# EAGLE design IR receiver_v10 (EAGLE 6.2)
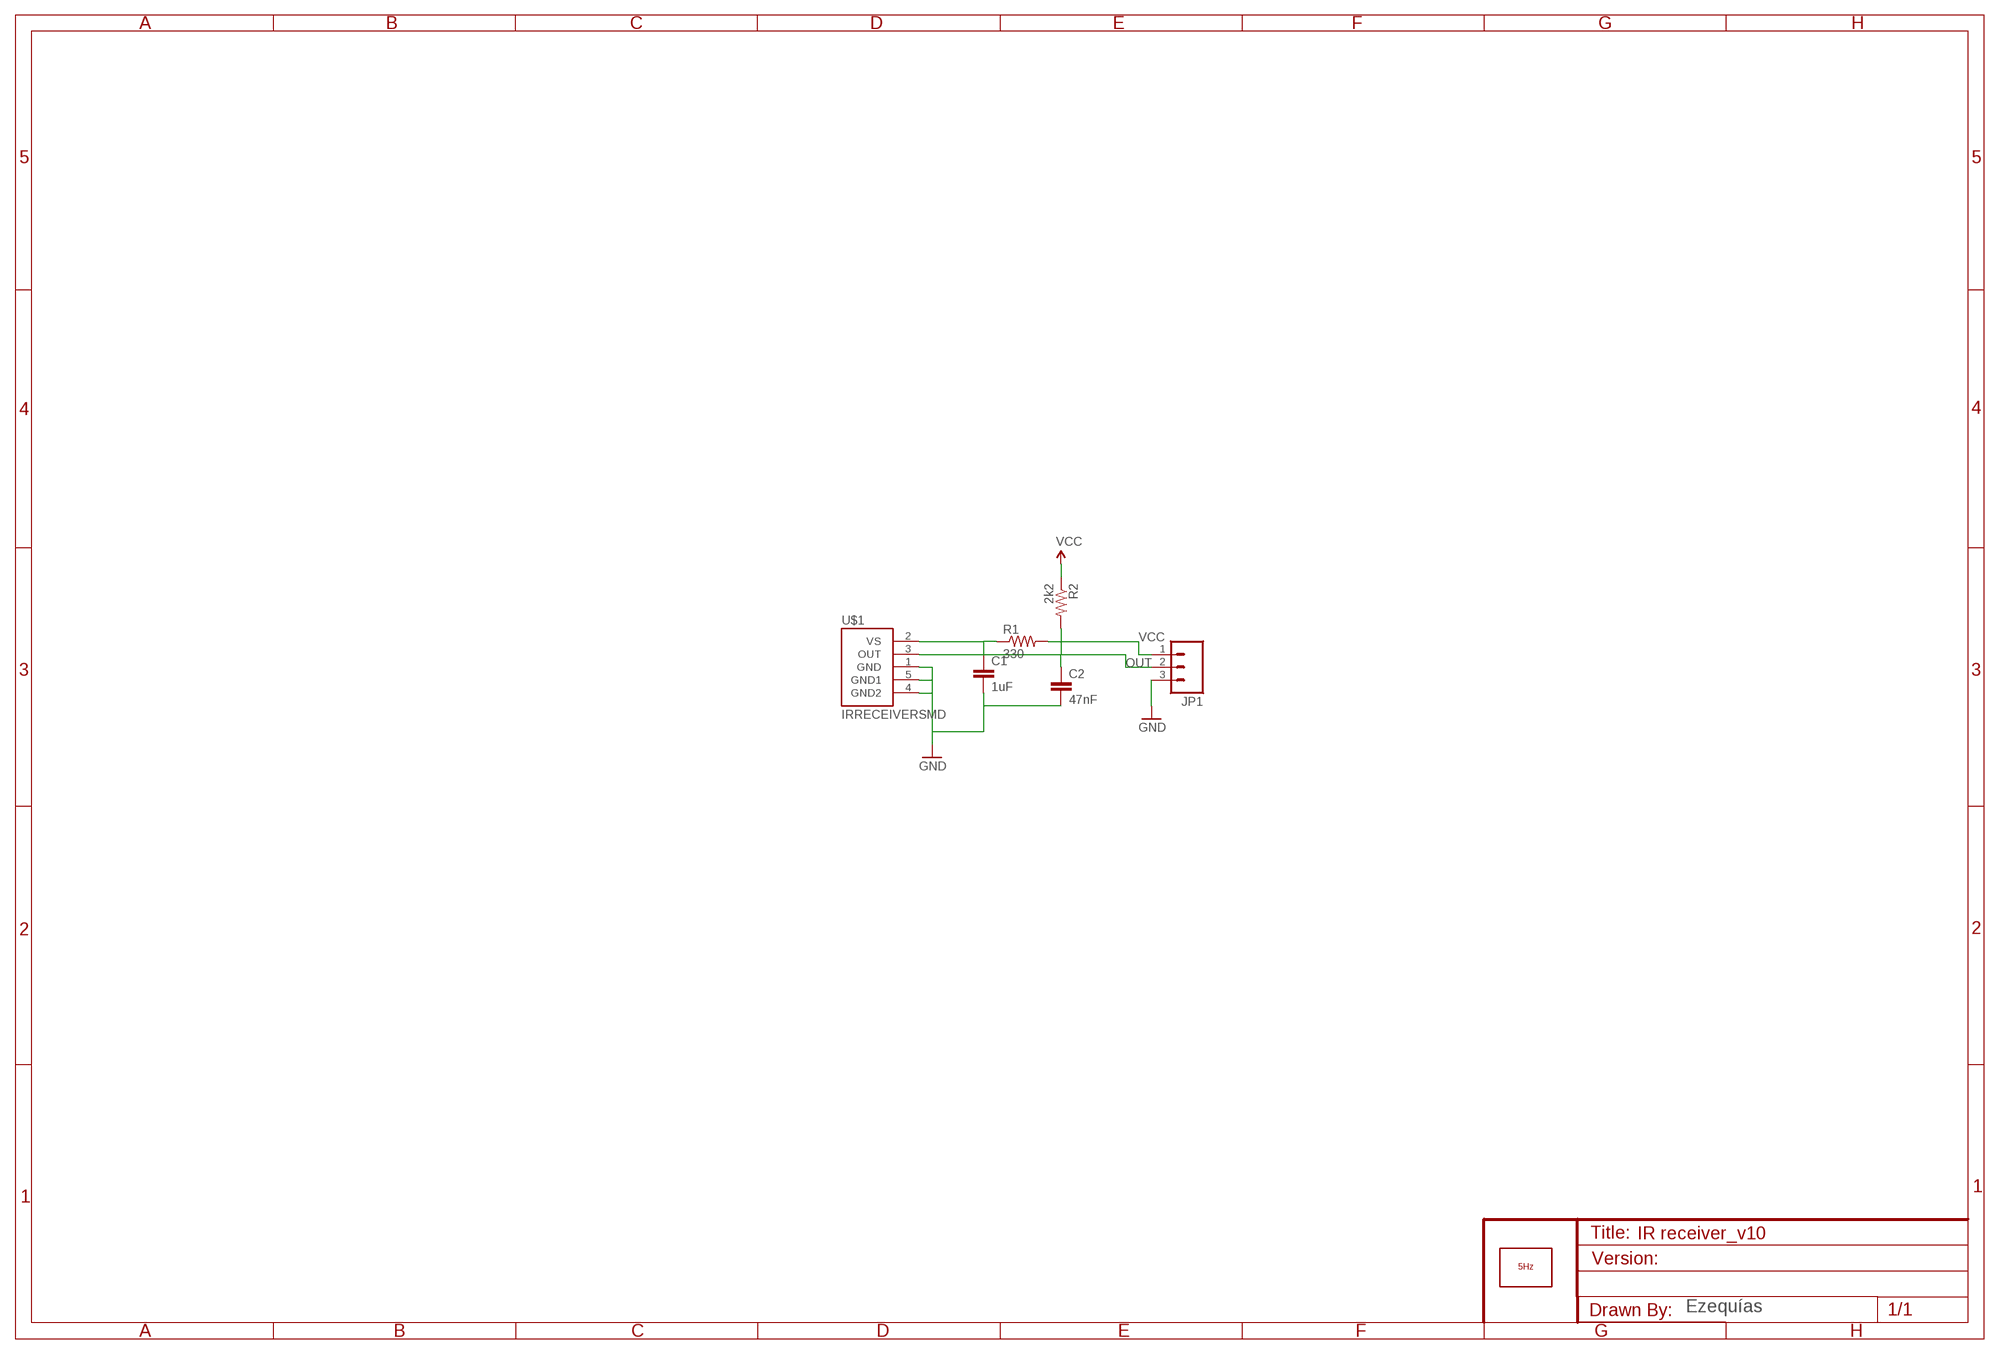
[diagram p0: schematic, sheet 1]

## Parts
C1  1uF  CAP0603-CAP  [0603-CAP]
C2  47nF  CAP0603-CAP  [0603-CAP]
JP1  M03PTH  [1X03]
LOGO1  LOGO_5HZ_MAIN_5MM  [5HZ_LOGO_MAIN_5MM]
R1  330  RESISTOR0603-RES  [0603-RES]
R2  2k2  RESISTOR0603-RES  [0603-RES]
U$1  IRRECEIVERSMD  [TSOP8523]

## Nets
GND: C1.2 C2.2 JP1.3 U$1.1(GND) U$1.4(GND2) U$1.5(GND1)
N$2: C1.1 R1.1 U$1.2(VS)
OUT: C2.1 JP1.2 R2.2 U$1.3(OUT)
VCC: JP1.1 R1.2 R2.1

## Notes on the sheet
- Ezequías

## Library data of the parts
C1 C2 = SparkFun:CAP: Capacitor Standard 0603 ceramic capacitor, and 0.1" leaded capacitor.
JP1 = SparkFun:M03: Header 3 Standard 3-pin 0.1" header. Use with straight break away headers (SKU : PRT-00116), right angle break away headers (PRT-00553), swiss pins (PRT-00743), machine pins (PRT-00117), and female headers (PRT-00115). Molex polarized connector foot print use with SKU : PRT-08232 with associated crimp pins and housings.
LOGO1 = 5hz-electronica:LOGO_5HZ: Logotipo 5Hz "según Pedro"
R1 R2 = SparkFun:RESISTOR: Resistor Basic schematic elements and footprints for 0603, 1206, and PTH resistors.
U$1 = SparkFun:IRRECEIVER: Description: IR receiver with built in demodulation and filtering. SparkFun SKU: SEN-08545

## Board
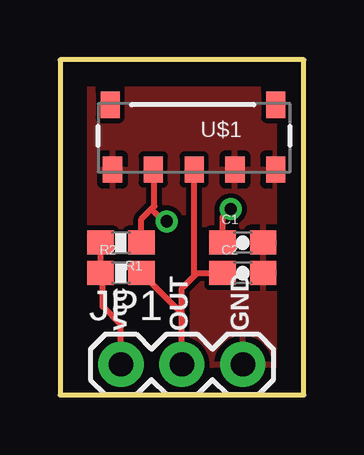
[diagram p1: board, top side]
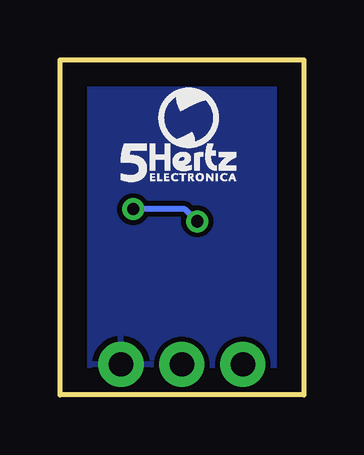
[diagram p2: board, bottom side, seen from below]

Size 10.16 x 13.97 mm. Coordinates in mm from the lower left corner, seen from the top.
Outline: 0,0 10.16,0 10.16,13.97 0,13.97 0,0
Copper layers (1*16): Top 0.035mm / dielectric 1.5mm / Bottom 0.035mm
Design rules: minimum track width 10mil, minimum drill 24mil, track to track 8mil, track to pad 8mil, pad to pad 8mil, via to via 8mil, smd to smd 8mil, copper to edge 40mil, drill to drill 8mil, minimum pad ring 10mil, minimum via ring 8mil, stop-mask expansion 4mil, vias tented up to drill 0mil, thermal gap 10mil

### Footprints (pad centres in the part's own frame; a part is rotated, then mirrored left to right if it is on the bottom)
0603-CAP = smd 1.1 x 1: 1 -0.85,0; 2 0.85,0
1X03 = drill 1.016 pad 1.88: 1 0,0; 2 2.54,0; 3 5.08,0
0603-RES = smd 1.1 x 1: 1 -0.85,0; 2 0.85,0
TSOP8523 = smd 0.8 x 1.1: 1 3.4,0; 2 1.7,0; 3 0,0; 4 -1.7,0; 5 -3.4,0; P$1 -3.4,-2.7; P$2 3.5,-2.7

### Placement (x,y rotation side)
C1  7.62,6.35 0 top
C2  7.62,5.08 0 top
JP1  2.54,1.27 0 top
LOGO1  7.62,8.89 0 bottom
R1  2.54,6.35 180 top
R2  2.54,5.08 0 top
U$1  5.59,9.4 180 top

### Tracks (layer width: path | path; a pad name or v marks a point on that pad's centre or on a via)
GND
  pour Bottom: 0,13.97 10.16,13.97 10.16,0 0,0
  pour Top: 0,13.97 10.16,13.97 10.16,0 0,0
N$2  (via drill 0.51)
  Top 0.254: R1.1 3.39,7.33 3.81,7.75 | 3.81,7.75 3.94,7.87 3.94,9.35 U$1.2 | C1.1 6.77,7.41 v7.11,7.75 | v4.45,7.24 4.32,7.24 3.81,7.75
  Bottom 0.254: v7.11,7.75 4.95,7.75 v4.45,7.24
OUT
  Top 0.254: JP1.2 5.08,3.39 | 5.08,3.39 R2.2 | 5.59,4.95 U$1.3 | 5.59,4.95 5.08,4.45 5.08,3.39 | C2.1 5.71,5.08 5.59,4.95
VCC
  Top 0.254: JP1.1 2.54,2.92 1.78,3.68 1.78,4.99 R2.1 R1.2

### Text on the board
tPlace: vcc | OUT | GND